# EAGLE design main_board (EAGLE 9.3.2)
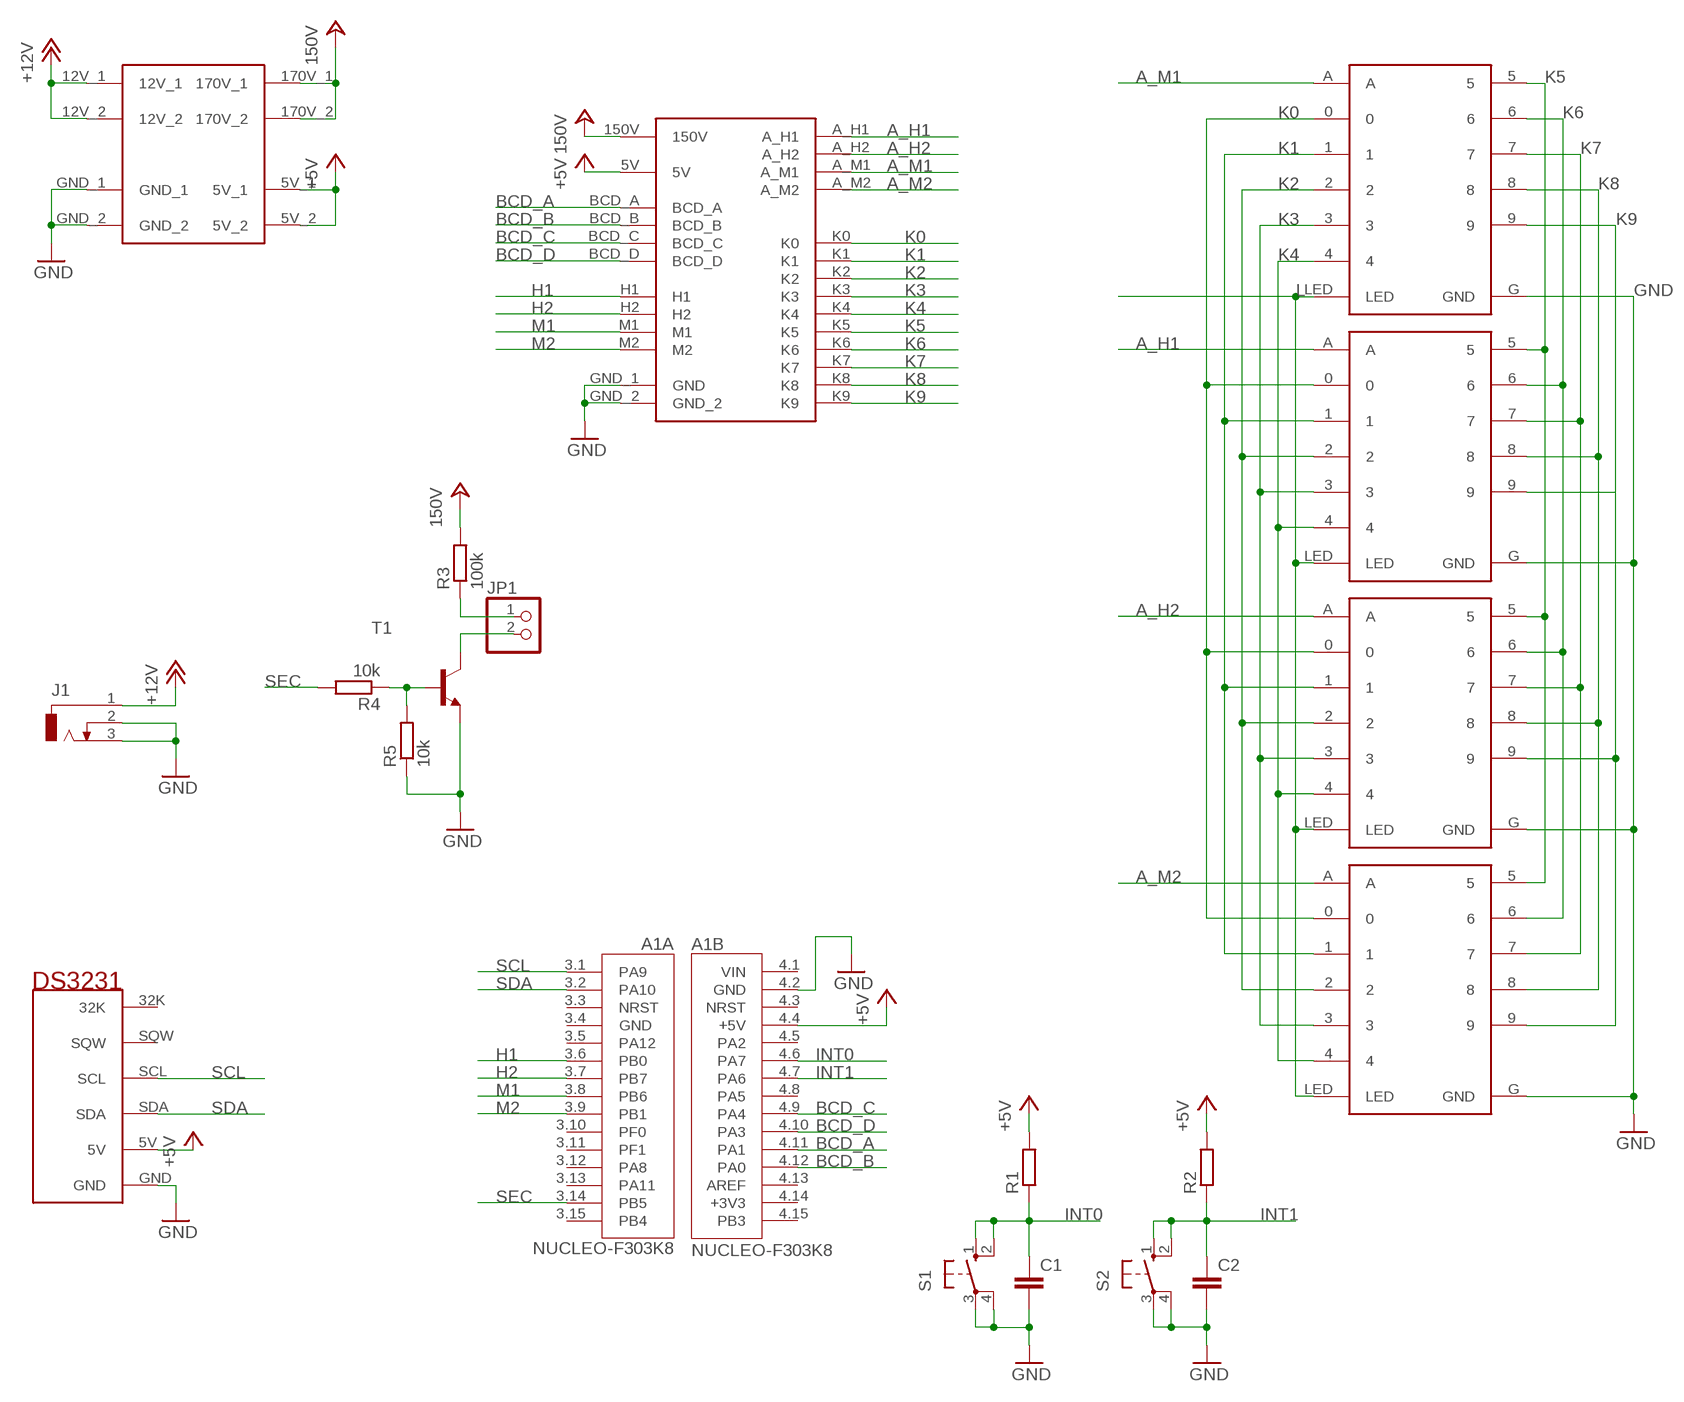
[diagram p0: schematic, sheet 1]

## Parts
A1  NUCLEO-F303K8  [MODULE_NUCLEO-F303K8]
C1  C-EUC1206  [C1206]
C2  C-EUC1206  [C1206]
J1  DCJ0303  [DCJ0303]
JP1  PINHD-1X2  [1X02]
R1  R-EU_R1206  [R1206]
R2  R-EU_R1206  [R1206]
R3  100k  R-EU_R1206  [R1206]
R4  10k  R-EU_R1206  [R1206]
R5  10k  R-EU_R1206  [R1206]
S1  10-XX  [B3F-10XX]
S2  10-XX  [B3F-10XX]
T1  MMBTA42LT1-NPN-SOT23-BEC  [SOT23-BEC]
U$1  Z570M_MODULE  [Z570M_MODULE]
U$2  Z570M_MODULE  [Z570M_MODULE]
U$3  Z570M_MODULE  [Z570M_MODULE]
U$4  Z570M_MODULE  [Z570M_MODULE]
U$5  POWER_MOUDLE  [POWER_MODULE]
U$6  RTC_MODULE  [RTC_MODULE]
U$7  MATRIX_MODULE  [MATRIX_MODULE]

## Nets
+5V: A1.4.4(B:+5V) R1.2 R2.2 U$5.5V_1 U$5.5V_2 U$6.5V U$7.5V
+12V: J1.1 U$5.12V_1 U$5.12V_2
+24V: R3.2 U$5.170V_1 U$5.170V_2 U$7.150V ; supply symbol labelled 150V
A_H1: U$4.A U$7.A_H1
A_H2: U$3.A U$7.A_H2
A_M1: U$1.A U$7.A_M1
A_M2: U$2.A U$7.A_M2
BCD_A: A1.4.11(B:PA1) U$7.BCD_A
BCD_B: A1.4.12(B:PA0) U$7.BCD_B
BCD_C: A1.4.9(B:PA4) U$7.BCD_C
BCD_D: A1.4.10(B:PA3) U$7.BCD_D
GND: A1.4.2(B:GND) C1.2 C2.2 J1.2 J1.3 R5.1 S1.3(P) S1.4(P1) S2.3(P) S2.4(P1) T1.E U$1.G(GND) U$2.G(GND) U$3.G(GND) U$4.G(GND) U$5.GND_1 U$5.GND_2 U$6.GND U$7.GND_1(GND) U$7.GND_2
H1: A1.3.6(A:PB0) U$7.H1
H2: A1.3.7(A:PB7) U$7.H2
INT0: A1.4.6(B:PA7) C1.1 R1.1 S1.1(S) S1.2(S1)
INT1: A1.4.7(B:PA6) C2.1 R2.1 S2.1(S) S2.2(S1)
K0: U$1.0 U$2.0 U$3.0 U$4.0 U$7.K0
K1: U$1.1 U$2.1 U$3.1 U$4.1 U$7.K1
K2: U$1.2 U$2.2 U$3.2 U$4.2 U$7.K2
K3: U$1.3 U$2.3 U$3.3 U$4.3 U$7.K3
K4: U$1.4 U$2.4 U$3.4 U$4.4 U$7.K4
K5: U$1.5 U$2.5 U$3.5 U$4.5 U$7.K5
K6: U$1.6 U$2.6 U$3.6 U$4.6 U$7.K6
K7: U$1.7 U$2.7 U$3.7 U$4.7 U$7.K7
K8: U$1.8 U$2.8 U$3.8 U$4.8 U$7.K8
K9: U$1.9 U$2.9 U$3.9 U$4.9 U$7.K9
L: U$1.LED U$2.LED U$3.LED U$4.LED
M1: A1.3.8(A:PB6) U$7.M1
M2: A1.3.9(A:PB1) U$7.M2
N$3: JP1.1 R3.1
N$4: JP1.2 T1.C
N$6: R4.1 R5.2 T1.B
SCL: A1.3.1(A:PA9) U$6.SCL
SDA: A1.3.2(A:PA10) U$6.SDA
SEC: A1.3.14(A:PB5) R4.2
Unconnected: A1.3.3(A:NRST) A1.3.4(A:GND) A1.3.5(A:PA12) A1.3.10(A:PF0) A1.3.11(A:PF1) A1.3.12(A:PA8) A1.3.13(A:PA11) A1.3.15(A:PB4) A1.4.1(B:VIN) A1.4.3(B:NRST) A1.4.5(B:PA2) A1.4.8(B:PA5) A1.4.13(B:AREF) A1.4.14(B:+3V3) A1.4.15(B:PB3) U$6.32K U$6.SQW

## Library data of the parts
A1 = NUCLEO-F303K8:NUCLEO-F303K8: STM32 Nucleo-32 development board with STM32F303K8T6 MCU, supports Arduino connectivity; AVAILABILITY: Unavailable; DESCRIPTION: STM32F303K8, mbed-Enabled Development Nucleo-32 STM32F3 ARM® Cortex®-M4 MCU 32-Bit Embedded Evaluation Board; MF: STMicroelectronics; MP: NUCLEO-F303K8; PACKAGE: None; PRICE: None
C1 C2 = rcl:C-EU: CAPACITOR, European symbol; SPICEPREFIX: C
J1 = con-jack:DCJ0303: DC POWER JACK Source: DCJ0303.pdf; OC_FARNELL: unknown; OC_NEWARK: unknown
JP1 = pinhead:PINHD-1X2: PIN HEADER
R1-R5 = rcl:R-EU_: RESISTOR, European symbol; SPICEPREFIX: R
S1 S2 = switch-omron:10-XX: OMRON SWITCH; MPN: B3F-1000; OC_FARNELL: 176432; OC_NEWARK: 36M3542
T1 = transistor:*-NPN-: NPN Transistror BF959 corrected 2008.03.06
U$1-U$4 = ligocki:Z570M_MODULE
U$5 = ligocki:POWER_MOUDLE
U$6 = ligocki:RTC_MODULE
U$7 = ligocki:MATRIX_MODULE

## Board
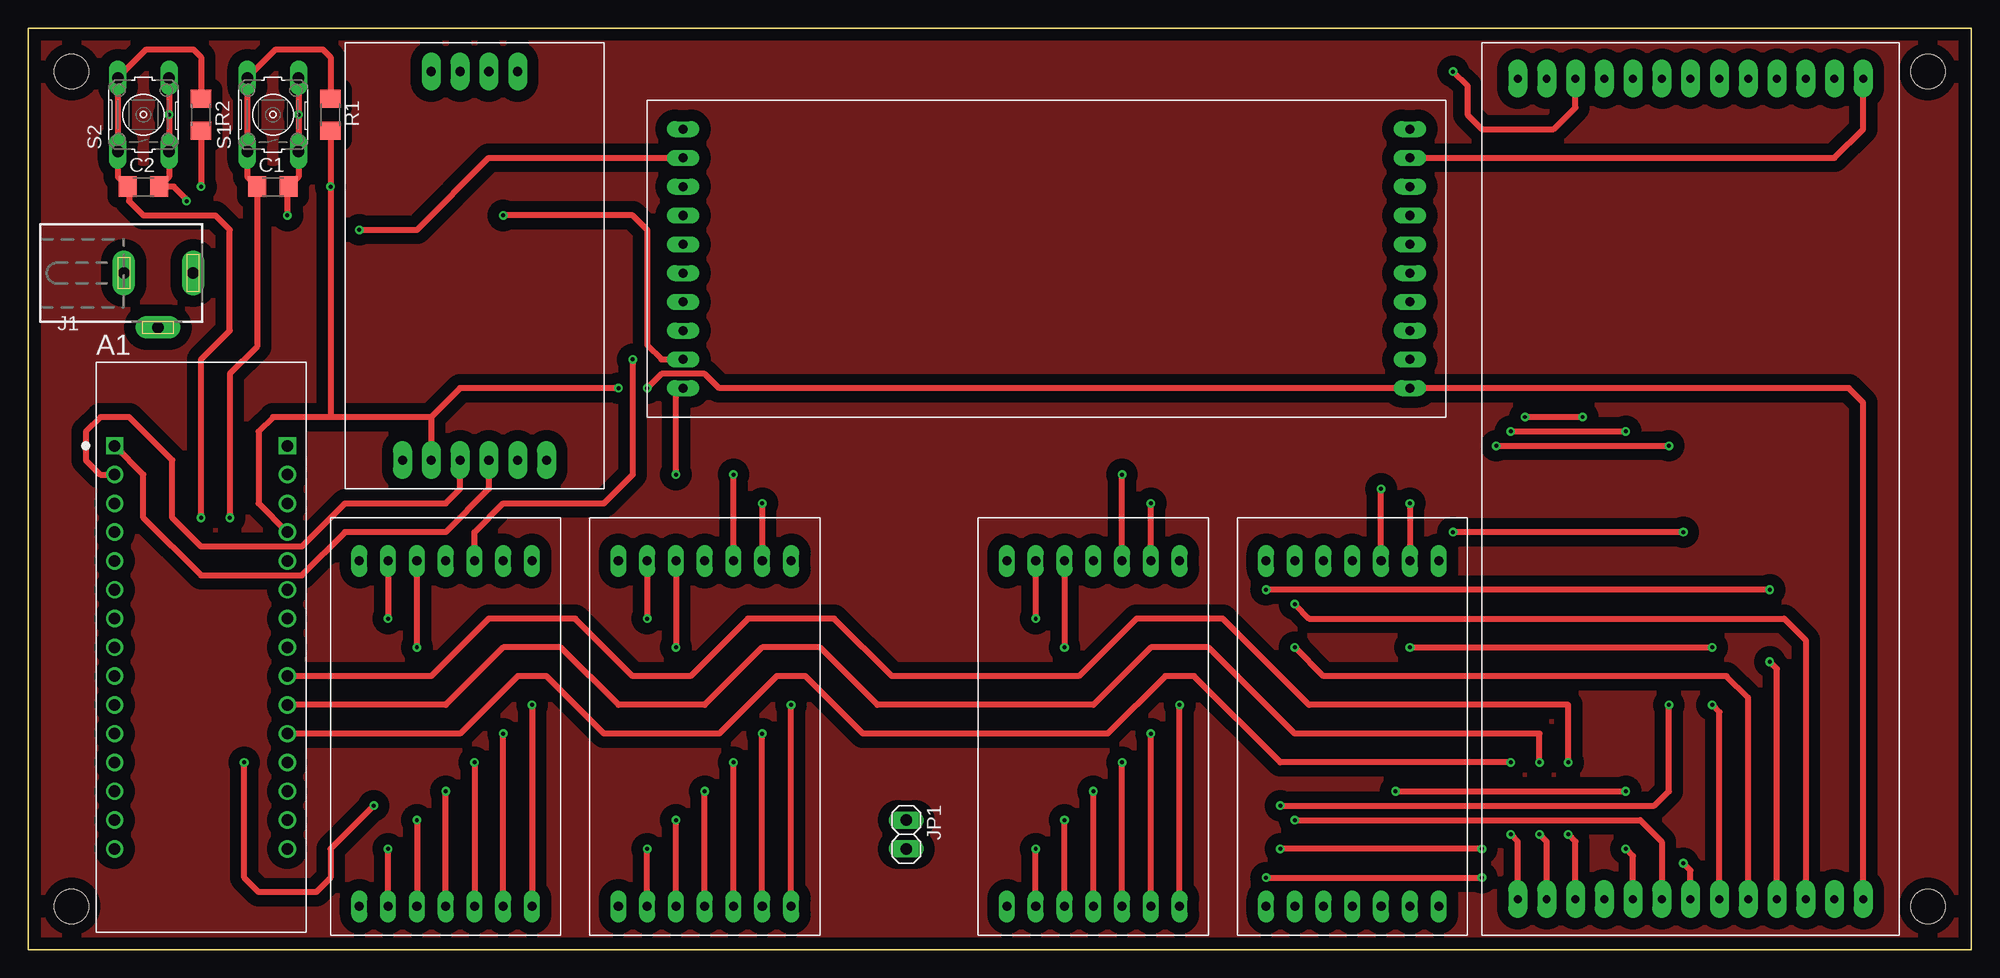
[diagram p1: board, top side]
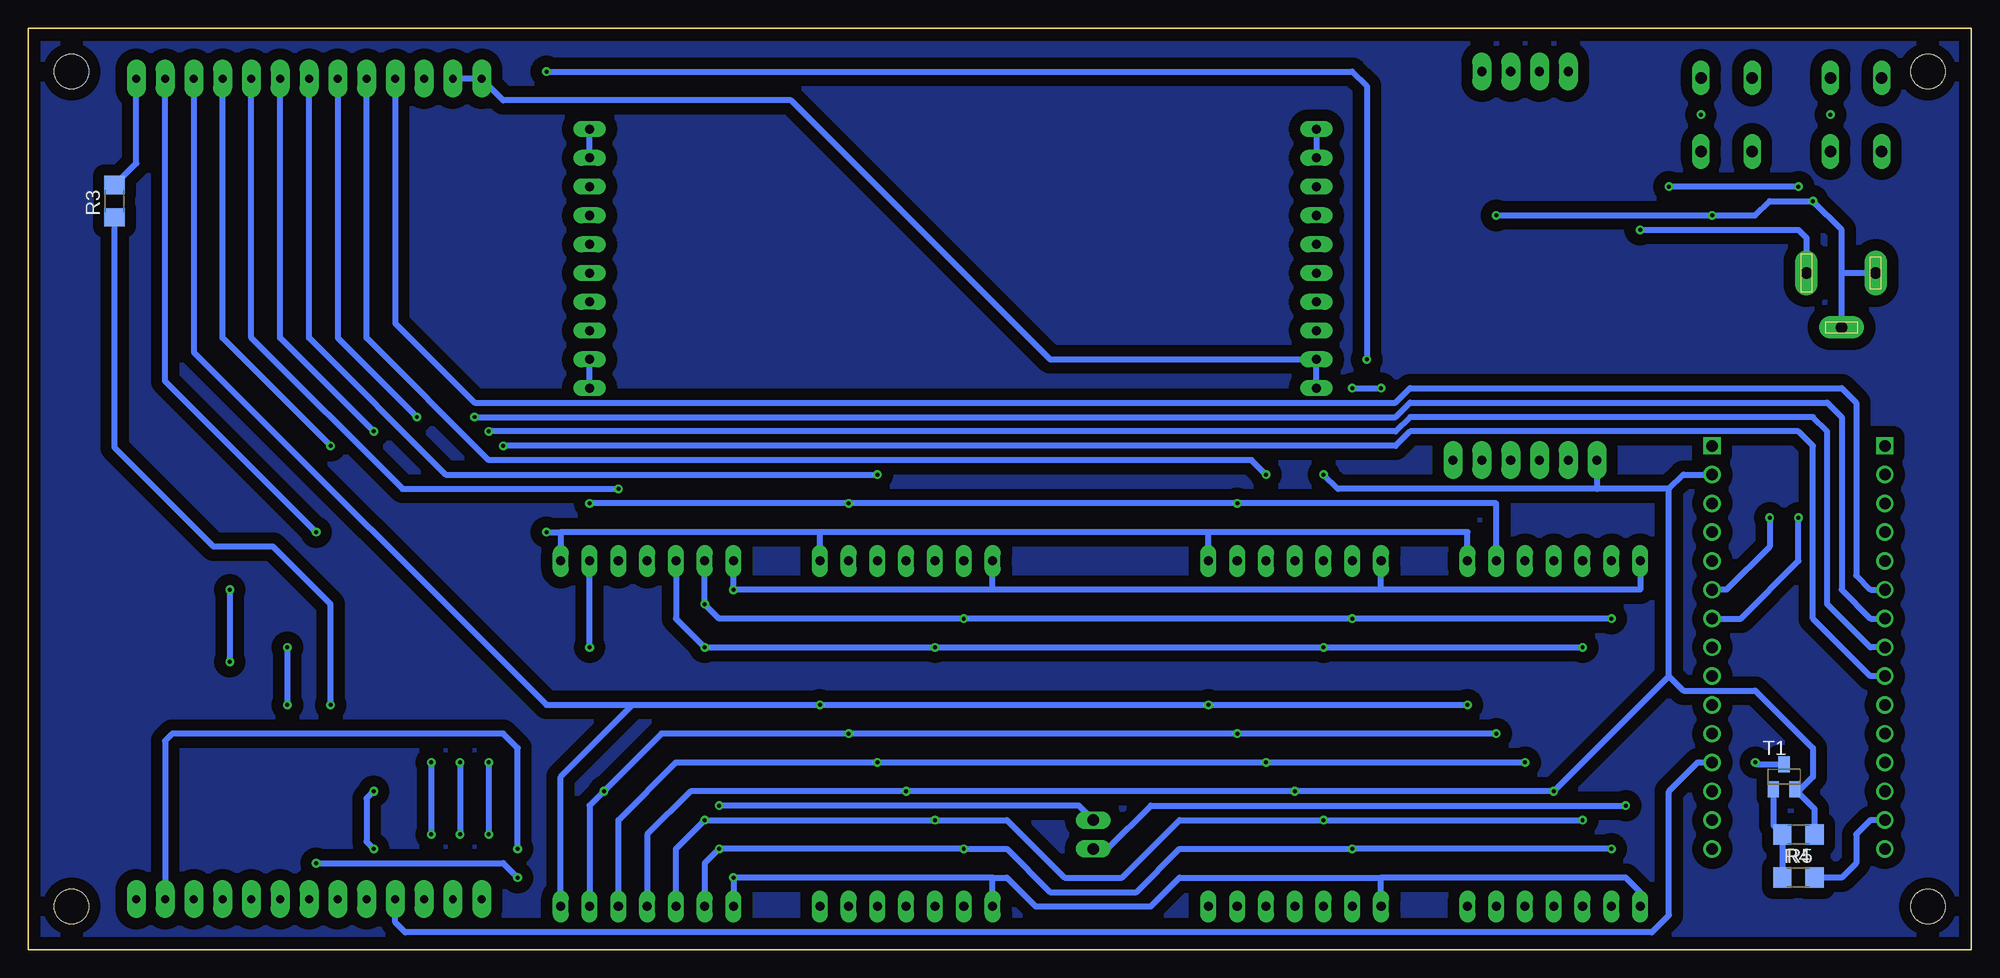
[diagram p2: board, bottom side, seen from below]

Size 171.45 x 81.28 mm. Coordinates in mm from the lower left corner, seen from the top.
Outline: 0,0 171.45,0 171.45,81.28 0,81.28 0,0
Copper layers (1*16): Top 0.035mm / dielectric 1.5mm / Bottom 0.035mm
Design rules "default": minimum track width 6mil, minimum drill 0.35mm, track to track 6mil, track to pad 6mil, pad to pad 6mil, via to via 6mil, smd to smd 6mil, copper to edge 40mil, drill to drill 6mil, minimum pad ring 10mil, minimum via ring 8mil, stop-mask expansion 4mil, vias tented up to drill 0mil, thermal gap 10mil
Holes 3 mm at 167.64,77.47 167.64,3.81 3.81,77.47 3.81,3.81

### Footprints (pad centres in the part's own frame; a part is rotated, then mirrored left to right if it is on the bottom)
MODULE_NUCLEO-F303K8 = drill 1.02 square: 3.1 -7.62,17.78; 4.1 7.62,17.78 | drill 1.02: 3.2 -7.62,15.24; 3.3 -7.62,12.7; 3.4 -7.62,10.16; 3.5 -7.62,7.62; 3.6 -7.62,5.08; 3.7 -7.62,2.54; 3.8 -7.62,0; 3.9 -7.62,-2.54; 3.10 -7.62,-5.08; 3.11 -7.62,-7.62; 3.12 -7.62,-10.16; 3.13 -7.62,-12.7; 3.14 -7.62,-15.24; 3.15 -7.62,-17.78; 4.2 7.62,15.24; 4.3 7.62,12.7; 4.4 7.62,10.16; 4.5 7.62,7.62; 4.6 7.62,5.08; 4.7 7.62,2.54; 4.8 7.62,0; 4.9 7.62,-2.54; 4.10 7.62,-5.08; 4.11 7.62,-7.62; 4.12 7.62,-10.16; 4.13 7.62,-12.7; 4.14 7.62,-15.24; 4.15 7.62,-17.78
C1206 = smd 1.6 x 1.8: 1 -1.4,0; 2 1.4,0
DCJ0303 = drill 1 pad 2 long: 1 0,3.1; 2 4.8,0; 3 0,-3
1X02 = drill 1.016 long: 1 -1.27,0; 2 1.27,0
R1206 = smd 1.6 x 1.803: 1 -1.422,0; 2 1.422,0
B3F-10XX = drill 1.016 long: 1 -3.251,2.261; 2 3.251,2.261; 3 -3.251,-2.261; 4 3.251,-2.261
SOT23-BEC = smd 1 x 1.4: B -0.95,-1.1; C 0,1.1; E 0.95,-1.1
Z570M_MODULE = drill 0.8 pad 1.422 long: 0 7.62,15.24; 1 -7.62,15.24; 2 -5.08,15.24; 3 -2.54,15.24; 4 -5.08,-15.24; 5 -7.62,-15.24; 6 -2.54,-15.24; 7 7.62,-15.24; 8 5.08,-15.24; 9 5.08,15.24; A 2.54,15.24; G 0,-15.24; LED 2.54,-15.24; P$10 0,15.24
POWER_MODULE = drill 0.8 pad 1.422 long: 5V_1 67.31,5.08; 5V_2 67.31,2.54; 12V_1 3.175,25.4; 12V_2 3.175,22.86; 170V_1 67.31,25.4; 170V_2 67.31,22.86; GND_1 3.175,5.08; GND_2 3.175,2.54; P$3 3.175,7.62; P$4 3.175,10.16; P$5 3.175,12.7; P$6 3.175,15.24; P$7 3.175,17.78; P$8 3.175,20.32; P$13 67.31,7.62; P$14 67.31,10.16; P$15 67.31,12.7; P$16 67.31,15.24; P$17 67.31,17.78; P$18 67.31,20.32
RTC_MODULE = drill 0.8 pad 1.676 long: 5V 36.83,7.62; 32K 36.83,17.78; GND 36.83,5.08; P$2 2.54,7.62; P$3 2.54,15.24; P$4 2.54,12.7; P$5 2.54,10.16; SCL 36.83,12.7; SDA 36.83,10.16; SQW 36.83,15.24
MATRIX_MODULE = drill 0.7 pad 1.676 long: 5V 75.565,33.655; 150V 3.175,33.655; A_H1 3.175,8.255; A_H2 3.175,13.335; A_M1 3.175,18.415; A_M2 3.175,23.495; BCD_A 75.565,3.175; BCD_B 75.565,10.795; BCD_C 75.565,8.255; BCD_D 75.565,5.715; GND_1 3.175,3.175; GND_2 3.175,5.715; H1 3.175,10.795; H2 3.175,15.875; K0 3.175,31.115; K1 75.565,26.035; K2 75.565,28.575; K3 75.565,23.495; K4 75.565,31.115; K5 75.565,18.415; K6 75.565,15.875; K7 3.175,28.575; K8 75.565,13.335; K9 75.565,20.955; M1 3.175,20.955; M2 3.175,26.035

### Placement (x,y rotation side)
A1  15.24,26.67 0 top
C1  21.59,67.31 0 top
C2  10.16,67.31 0 top
J1  11.43,59.69 270 top
JP1  77.47,10.16 270 top
R1  26.67,73.66 270 top
R2  15.24,73.66 270 top
R3  163.83,66.04 90 bottom
R4  15.24,6.35 0 bottom
R5  15.24,10.16 180 bottom
S1  21.59,73.66 90 top
S2  10.16,73.66 90 top
T1  16.51,15.24 0 bottom
U$1  93.98,19.05 0 top
U$2  116.84,19.05 0 top
U$3  59.69,19.05 0 top
U$4  36.83,19.05 0 top
U$5  54.61,46.99 0 top
U$6  27.94,80.01 270 top
U$7  128.27,80.01 270 top

### Tracks (layer width: path | path; a pad name or v marks a point on that pad's centre or on a via)
+5V  (via drill 0.35)
  Top 0.508: v54.61,49.53 55.88,50.8 59.69,50.8 60.96,49.53 U$5.5V_2 160.66,49.53 161.93,48.26 U$7.5V | 35.56,46.99 26.67,46.99 | 26.67,46.99 21.59,46.99 20.32,45.72 20.32,39.37 A1.4.4 | 26.67,46.99 v26.67,67.31 R1.2 | R2.2 v15.24,67.31 | 35.56,46.99 U$6.5V | v52.07,49.53 38.1,49.53 35.56,46.99
  Bottom 0.508: U$5.5V_2 U$5.5V_1 | v15.24,67.31 v26.67,67.31 | v54.61,49.53 v52.07,49.53
+12V  (via drill 0.35)
  Top 0.508: v29.21,63.5 34.29,63.5 40.64,69.85 U$5.12V_2
  Bottom 0.508: U$5.12V_1 U$5.12V_2 | J1.1 14.53,62.79 15.24,63.5 v29.21,63.5
+24V
  Top 0.508: U$7.150V 161.93,72.39 159.38,69.85 U$5.170V_2
  Bottom 0.508: U$5.170V_2 U$5.170V_1 | R3.2 161.93,69.37 U$7.150V
A_H1  (via drill 0.35)
  Top 0.508: U$4.A 39.37,36.83 41.91,39.37 50.8,39.37 53.34,41.91 v53.34,52.07 | v125.73,77.47 127,76.2 127,73.66 128.27,72.39 134.62,72.39 136.53,74.3 U$7.A_H1
  Bottom 0.508: v125.73,77.47 54.61,77.47 53.34,76.2 v53.34,52.07
A_H2  (via drill 0.35)
  Top 0.508: U$3.A v62.23,41.91
  Bottom 0.508: v62.23,41.91 63.5,43.18 130.81,43.18 141.6,53.98 U$7.A_H2
A_M1  (via drill 0.35)
  Top 0.508: U$1.A v96.52,41.91
  Bottom 0.508: v96.52,41.91 134.62,41.91 146.69,53.98 U$7.A_M1
A_M2  (via drill 0.35)
  Top 0.508: U$2.A v119.38,40.64
  Bottom 0.508: v119.38,40.64 138.43,40.64 151.76,53.98 U$7.A_M2
BCD_A  (via drill 0.35)
  Top 0.508: A1.4.11 38.1,19.05 43.18,24.13 45.72,24.13 50.8,19.05 60.96,19.05 66.04,24.13 68.58,24.13 73.66,19.05 95.25,19.05 100.33,24.13 102.87,24.13 110.49,16.51 v130.81,16.51 | U$7.BCD_A 131.44,9.53 v130.81,10.16
  Bottom 0.508: v130.81,16.51 v130.81,10.16
BCD_B
  Bottom 0.508: A1.4.12 24.13,16.51 26.67,13.97 26.67,3.05 28.19,1.52 138.18,1.52 139.06,2.41 U$7.BCD_B
BCD_C  (via drill 0.35)
  Top 0.508: v135.89,16.51 135.89,21.59 113.03,21.59 105.41,29.21 97.79,29.21 92.71,24.13 76.2,24.13 71.12,29.21 63.5,29.21 58.42,24.13 53.34,24.13 48.26,29.21 40.64,29.21 35.56,24.13 A1.4.9 | U$7.BCD_C 136.53,9.53 v135.89,10.16
  Bottom 0.508: v135.89,16.51 v135.89,10.16
BCD_D  (via drill 0.35)
  Top 0.508: v133.35,16.51 133.35,19.05 111.76,19.05 104.14,26.67 99.06,26.67 93.98,21.59 74.93,21.59 69.85,26.67 64.77,26.67 59.69,21.59 52.07,21.59 46.99,26.67 41.91,26.67 36.83,21.59 A1.4.10 | U$7.BCD_D 133.99,9.53 v133.35,10.16
  Bottom 0.508: v133.35,16.51 v133.35,10.16
GND  (via drill 0.35)
  Top 0.508: U$4.G v36.83,13.97 | U$1.G v93.98,13.97 | U$3.G v59.69,13.97 | S2.4 v12.42,73.66 S2.3 12.42,68.17 C2.2 12.83,67.31 13.97,66.17 v13.97,66.04 | S1.4 v23.85,73.66 S1.3 23.85,68.17 C1.2 22.86,67.18 v22.86,64.77 | v41.91,64.77 53.34,64.77 54.61,63.5 54.61,53.34 55.88,52.07 U$5.GND_1 | v57.15,41.91 57.15,48.9 U$5.GND_2
  Bottom 0.508: U$5.GND_2 U$5.GND_1 81.28,52.07 104.14,74.93 129.54,74.93 U$7.GND_1 U$7.GND_2 | U$2.G 116.84,10.16 113.03,13.97 v93.98,13.97 v59.69,13.97 v36.83,13.97 26.67,24.13 | 26.67,24.13 26.67,40.64 | 26.67,40.64 25.4,41.91 A1.4.2 | U$6.GND 33.02,40.64 | 33.02,40.64 55.88,40.64 v57.15,41.91 | J1.3 11.43,59.69 | 11.43,59.69 11.43,63.5 v13.97,66.04 17.78,66.04 19.05,64.77 v22.86,64.77 v41.91,64.77 | J1.2 11.43,59.69 | 26.67,24.13 25.4,22.86 19.05,22.86 13.97,17.78 13.97,15.24 15.07,14.14 T1.E 13.82,12.4 R5.1 | 26.67,40.64 33.02,40.64
H1
  Bottom 0.508: U$7.H1 139.06,55.24 132.08,48.26 50.8,48.26 49.53,49.53 11.43,49.53 10.16,48.26 10.16,33.02 8.89,31.75 A1.3.6
H2  (via drill 0.35)
  Top 0.508: v137.16,46.99 v132.08,46.99
  Bottom 0.508: U$7.H2 144.15,53.98 v137.16,46.99 | v132.08,46.99 50.8,46.99 49.53,48.26 12.7,48.26 11.43,46.99 11.43,31.75 8.89,29.21 A1.3.7
INT0  (via drill 0.35)
  Top 0.508: R1.1 26.67,78.74 25.98,79.43 21.84,79.43 S1.2 S1.1 19.33,68.17 C1.1 20.19,53.21 17.78,50.8 v17.78,38.1
  Bottom 0.508: v17.78,38.1 17.78,35.56 21.59,31.75 A1.4.6
INT1  (via drill 0.35)
  Top 0.508: R2.1 15.24,78.74 14.55,79.43 10.41,79.43 S2.2 S2.1 7.9,68.17 C2.1 8.89,67.18 8.89,66.04 10.16,64.77 16.51,64.77 17.78,63.5 17.78,54.61 15.24,52.07 v15.24,38.1
  Bottom 0.508: A1.4.7 20.32,29.21 15.24,34.29 v15.24,38.1
K0  (via drill 0.35)
  Top 0.508: v146.05,36.83 v125.73,36.83
  Bottom 0.508: U$4.0 44.45,36.83 67.31,36.83 | 67.31,36.83 101.6,36.83 | 101.6,36.83 124.46,36.83 | 124.46,36.83 U$2.0 | U$1.0 101.6,36.83 | U$3.0 67.31,36.83 | v125.73,36.83 124.46,36.83 | U$7.K0 159.38,50.16 v146.05,36.83
K1  (via drill 0.35)
  Top 0.508: v153.67,31.75 v109.22,31.75 | U$7.K1 154.31,24.77 v153.67,25.4
  Bottom 0.508: U$4.1 29.21,31.75 52.07,31.75 | 52.07,31.75 U$3.1 | 52.07,31.75 86.36,31.75 | 86.36,31.75 U$1.1 | U$2.1 v109.22,31.75 86.36,31.75 | v153.67,31.75 v153.67,25.4
K2  (via drill 0.35)
  Top 0.508: U$4.2 v31.75,29.21 | U$3.2 v54.61,29.21 | U$1.2 v88.9,29.21 | v111.76,30.48 113.03,29.21 154.94,29.21 156.84,27.3 U$7.K2
  Bottom 0.508: v31.75,29.21 v54.61,29.21 v88.9,29.21 110.49,29.21 v111.76,30.48 U$2.2
K3  (via drill 0.35)
  Top 0.508: v34.29,26.67 U$4.3 | U$3.3 v57.15,26.67 | U$1.3 v91.44,26.67 | v111.76,26.67 114.3,24.13 149.86,24.13 151.76,22.23 U$7.K3
  Bottom 0.508: v34.29,26.67 v57.15,26.67 v91.44,26.67 v111.76,26.67 114.3,29.21 U$2.3
K4  (via drill 0.35)
  Top 0.508: U$4.4 v31.75,8.89 | U$1.4 v88.9,8.89 | U$3.4 v54.61,8.89 | v128.27,8.89 v110.49,8.89
  Bottom 0.508: v31.75,8.89 v54.61,8.89 69.85,8.89 73.66,5.08 81.28,5.08 85.09,8.89 v88.9,8.89 v110.49,8.89 111.76,7.62 U$2.4 | v128.27,8.89 128.27,17.78 129.54,19.05 158.75,19.05 159.38,18.41 U$7.K4
K5  (via drill 0.35)
  Top 0.508: v109.22,6.35 v128.27,6.35 | U$7.K5 146.69,6.99 v146.05,7.62
  Bottom 0.508: U$4.5 29.21,5.08 30.48,6.35 52.07,6.35 | 86.36,6.35 v109.22,6.35 U$2.5 | U$3.5 52.07,6.35 | U$1.5 86.36,6.35 | v128.27,6.35 129.54,7.62 v146.05,7.62 | 86.36,6.35 85.09,6.35 82.55,3.81 72.39,3.81 69.85,6.35 52.07,6.35
K6  (via drill 0.35)
  Top 0.508: v34.29,11.43 U$4.6 | U$1.6 v91.44,11.43 | U$3.6 v57.15,11.43 | v111.76,11.43 142.24,11.43 144.15,9.53 U$7.K6
  Bottom 0.508: U$2.6 114.3,8.89 v111.76,11.43 v91.44,11.43 85.09,11.43 80.01,6.35 74.93,6.35 69.85,11.43 v57.15,11.43 v34.29,11.43
K7  (via drill 0.35)
  Top 0.508: v44.45,21.59 U$4.7 | U$1.7 v101.6,21.59 | U$3.7 v67.31,21.59
  Bottom 0.508: U$2.7 124.46,15.24 118.11,21.59 | 118.11,21.59 v101.6,21.59 v67.31,21.59 v44.45,21.59 | 118.11,21.59 125.73,21.59 156.84,52.7 U$7.K7
K8  (via drill 0.35)
  Top 0.508: U$4.8 v41.91,19.05 | U$1.8 v99.06,19.05 | U$3.8 v64.77,19.05 | v120.65,13.97 v140.97,13.97 | U$7.K8 141.6,8.26 v140.97,8.89
  Bottom 0.508: v41.91,19.05 v64.77,19.05 v99.06,19.05 115.57,19.05 v120.65,13.97 121.92,12.7 U$2.8 | v140.97,13.97 141.6,13.34 141.6,9.53 v140.97,8.89
K9  (via drill 0.35)
  Top 0.508: v121.92,39.37 U$2.9 | U$1.9 v99.06,39.37 | v64.77,39.37 U$3.9 | v121.92,26.67 v148.59,26.67 | U$7.K9 149.22,20.95 v148.59,21.59
  Bottom 0.508: U$4.9 41.91,39.37 v64.77,39.37 v99.06,39.37 v121.92,39.37 | v121.92,26.67 U$2.9 | v148.59,26.67 v148.59,21.59
L  (via drill 0.35)
  Top 0.508: v39.37,16.51 U$4.LED | U$1.LED v96.52,16.51 | U$3.LED v62.23,16.51
  Bottom 0.508: U$2.LED 119.38,11.43 114.3,16.51 v96.52,16.51 v62.23,16.51 v39.37,16.51
M1  (via drill 0.35)
  Top 0.508: v130.81,45.72 v140.97,45.72
  Bottom 0.508: A1.3.8 8.89,26.67 12.7,30.48 12.7,45.72 13.97,46.99 49.53,46.99 50.8,45.72 v130.81,45.72 | v140.97,45.72 149.22,53.98 U$7.M1
M2  (via drill 0.35)
  Top 0.508: v129.54,44.45 v144.78,44.45
  Bottom 0.508: A1.3.9 8.89,24.13 13.97,29.21 13.97,44.45 15.24,45.72 49.53,45.72 50.8,44.45 v129.54,44.45 | v144.78,44.45 154.31,53.98 U$7.M2
N$1
  pour Top (isolate 1): 0,0 171.45,0 171.45,81.28 0,81.28
N$2
  pour Bottom (isolate 1): 0,81.28 0,0 171.45,0 171.45,81.28
N$3  (via drill 0.35)
  Top 0.508: v110.49,12.7 143.51,12.7 144.78,13.97 v144.78,21.59
  Bottom 0.508: JP1.1 78.74,12.7 v110.49,12.7 | v144.78,21.59 144.78,30.48 149.86,35.56 155.09,35.56 163.83,44.3 R3.1
N$4  (via drill 0.35)
  Top 0.508: v30.48,12.7 26.67,8.89 26.67,6.35 25.4,5.08 20.32,5.08 19.05,6.35 v19.05,16.51
  Bottom 0.508: JP1.2 76.2,8.89 72.39,12.7 v30.48,12.7 | v19.05,16.51 18.88,16.34 T1.C
N$6
  Bottom 0.508: T1.B 17.46,10.96 R5.2 R4.1
SCL
  Top 0.508: U$6.SCL 40.64,40.64 36.83,36.83 27.94,36.83 24.13,33.02 15.24,33.02 10.16,38.1 10.16,41.91 A1.3.1
SDA
  Top 0.508: U$6.SDA 38.1,40.64 36.83,39.37 27.94,39.37 24.13,35.56 15.24,35.56 12.7,38.1 12.7,43.18 8.89,46.99 6.35,46.99 5.08,45.72 5.08,43.18 6.35,41.91 A1.3.2
SEC
  Bottom 0.508: A1.3.14 8.89,11.43 10.16,10.16 10.16,7.62 11.43,6.35 R4.2